# Altium schematic sheet CPLD.SchDoc
size A3; : Record=PageOptions|CenterHorizontal=True|CenterVertical=True|PrintScale=0.70|XCorrection=1.00|YCorrection=1.00|PrintKind=1|BorderSize=5000000|LeftOffset=0|BottomOffset=0|Orientation=2|PaperLength=1000|PaperWidth=1000|Scale=100|PaperSource=7|PrintQuality=-4|MediaType=1|DitherType=10|PaperKin
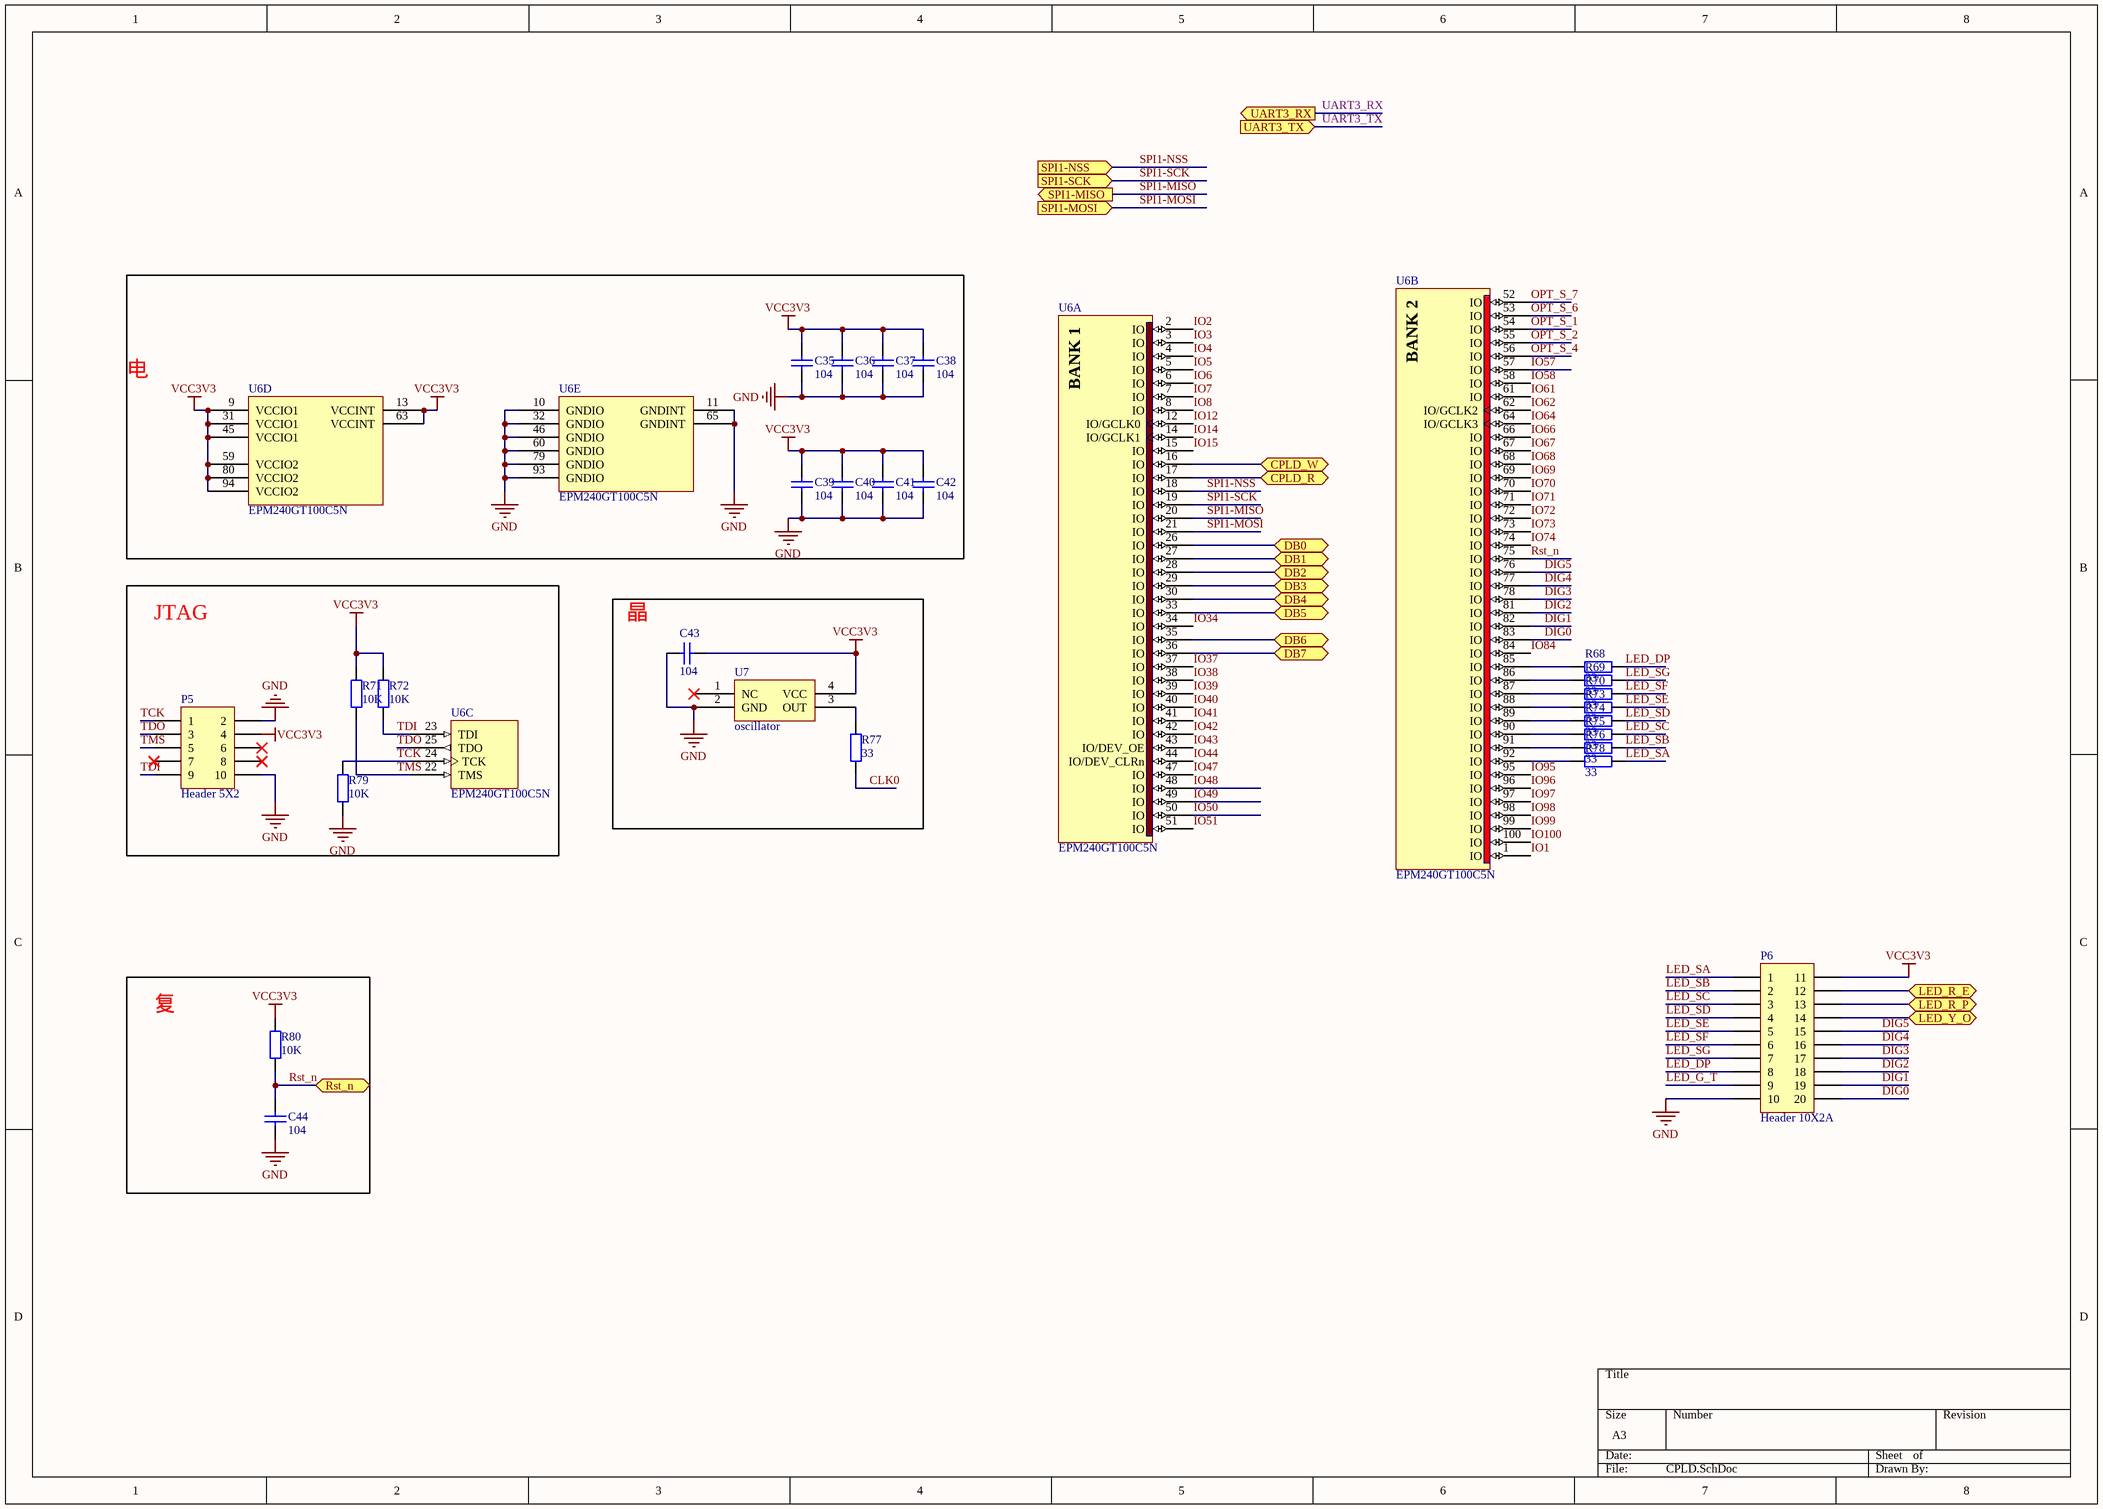
[diagram p0: CPLD.SchDoc]

## Parts
C35  value 104  [C0805]  (hidden comment: Cap)
C36  value 104  [C0805]  (hidden comment: Cap)
C37  value 104  [C0805]  (hidden comment: Cap)
C38  value 104  [C0805]  (hidden comment: Cap)
C39  value 104  [C0805]  (hidden comment: Cap)
C40  value 104  [C0805]  (hidden comment: Cap)
C41  value 104  [C0805]  (hidden comment: Cap)
C42  value 104  [C0805]  (hidden comment: Cap)
C43  value 104  [C0805]  (hidden comment: Cap)
C44  value 104  [C0805]  (hidden comment: Cap)
P5  Header 5X2  [HDR2X5]
P6  Header 10X2A  [HDR2X10_CEN]
R68  value 33  [R0805]  (hidden comment: Res2)
R69  value 33  [R0805]  (hidden comment: Res2)
R70  value 33  [R0805]  (hidden comment: Res2)
R71  value 10K  [R0805]  (hidden comment: Res2)
R72  value 10K  [R0805]  (hidden comment: Res2)
R73  value 33  [R0805]  (hidden comment: Res2)
R74  value 33  [R0805]  (hidden comment: Res2)
R75  value 33  [R0805]  (hidden comment: Res2)
R76  value 33  [R0805]  (hidden comment: Res2)
R77  value 33  [R0805]  (hidden comment: Res2)
R78  value 33  [R0805]  (hidden comment: Res2)
R79  value 10K  [R0805]  (hidden comment: Res2)
R80  value 10K  [R0805]  (hidden comment: Res2)
U6  EPM240GT100C5N  [TQFP100_N]  (parts A,B,C,D,E of 5)
U7  oscillator  [JZ]

## Blocks framed on the sheet
电: C35-C42 U6
JTAG: P5 R71 R72 R79 U6
晶: C43 R77 U7
复: C44 R80

## Ports
CPLD_R (bidir), CPLD_W (bidir), DB0 (bidir), DB1 (bidir), DB2 (bidir), DB3 (bidir), DB4 (bidir), DB5 (bidir), DB6 (bidir), DB7 (bidir), LED_R_E (bidir), LED_R_P (bidir), LED_Y_O (bidir), Rst_n (bidir), SPI1-MISO (out), SPI1-MOSI (in), SPI1-NSS (in), SPI1-SCK (in), UART3_RX (out), UART3_TX (in)

## Nets
GND: C35.1 C36.1 C37.1 C38.1 C39.1 C40.1 C41.1 C42.1 C43.1 C44.1 P5.2 P5.10 P6.10 R79.1 U6.10(GNDIO) U6.11(GNDINT) U6.32(GNDIO) U6.46(GNDIO) U6.60(GNDIO) U6.65(GNDINT) U6.79(GNDIO) U6.93(GNDIO) U7.2(GND)
VCC3V3: C35.2 C36.2 C37.2 C38.2 C39.2 C40.2 C41.2 C42.2 C43.2 P5.4 P6.11 R71.2 R72.2 R80.2 U6.9(VCCIO1) U6.13(VCCINT) U6.31(VCCIO1) U6.45(VCCIO1) U6.59(VCCIO2) U6.63(VCCINT) U6.80(VCCIO2) U6.94(VCCIO2) U7.4(VCC)
CLK0: R77.1
CPLD_R: U6.17(IO) ; port CPLD_R
CPLD_W: U6.16(IO) ; port CPLD_W
DB0: U6.26(IO) ; port DB0
DB1: U6.27(IO) ; port DB1
DB2: U6.28(IO) ; port DB2
DB3: U6.29(IO) ; port DB3
DB4: U6.30(IO) ; port DB4
DB5: U6.33(IO) ; port DB5
DB6: U6.35(IO) ; port DB6
DB7: U6.36(IO) ; port DB7
DIG0: P6.20 U6.83(IO)
DIG1: P6.19 U6.82(IO)
DIG2: P6.18 U6.81(IO)
DIG3: P6.17 U6.78(IO)
DIG4: P6.16 U6.77(IO)
DIG5: P6.15 U6.76(IO)
IO1: U6.1(IO)
IO2: U6.2(IO)
IO3: U6.3(IO)
IO4: U6.4(IO)
IO5: U6.5(IO)
IO6: U6.6(IO)
IO7: U6.7(IO)
IO8: U6.8(IO)
IO12: U6.12(IO/GCLK0)
IO14: U6.14(IO/GCLK1)
IO15: U6.15(IO)
IO34: U6.34(IO)
IO37: U6.37(IO)
IO38: U6.38(IO)
IO39: U6.39(IO)
IO40: U6.40(IO)
IO41: U6.41(IO)
IO42: U6.42(IO)
IO43: U6.43(IO/DEV_OE)
IO44: U6.44(IO/DEV_CLRn)
IO47: U6.47(IO)
IO48: U6.48(IO)
IO49: U6.49(IO)
IO50: U6.50(IO)
IO51: U6.51(IO)
IO57: U6.57(IO)
IO58: U6.58(IO)
IO61: U6.61(IO)
IO62: U6.62(IO/GCLK2)
IO64: U6.64(IO/GCLK3)
IO66: U6.66(IO)
IO67: U6.67(IO)
IO68: U6.68(IO)
IO69: U6.69(IO)
IO70: U6.70(IO)
IO71: U6.71(IO)
IO72: U6.72(IO)
IO73: U6.73(IO)
IO74: U6.74(IO)
IO84: U6.84(IO)
IO95: U6.95(IO)
IO96: U6.96(IO)
IO97: U6.97(IO)
IO98: U6.98(IO)
IO99: U6.99(IO)
IO100: U6.100(IO)
LED_DP: P6.8 R68.1
LED_G_T: P6.9
LED_R_E: P6.12 ; port LED_R_E
LED_R_P: P6.13 ; port LED_R_P
LED_SA: P6.1 R78.1
LED_SB: P6.2 R76.1
LED_SC: P6.3 R75.1
LED_SD: P6.4 R74.1
LED_SE: P6.5 R73.1
LED_SF: P6.6 R70.1
LED_SG: P6.7 R69.1
LED_Y_O: P6.14 ; port LED_Y_O
OPT_S_1: U6.54(IO)
OPT_S_2: U6.55(IO)
OPT_S_4: U6.56(IO)
OPT_S_6: U6.53(IO)
OPT_S_7: U6.52(IO)
Rst_n: C44.2 R80.1 U6.75(IO) ; port Rst_n
SPI1-MISO: U6.20(IO) ; port SPI1-MISO
SPI1-MOSI: U6.21(IO) ; port SPI1-MOSI
SPI1-NSS: U6.18(IO) ; port SPI1-NSS
SPI1-SCK: U6.19(IO) ; port SPI1-SCK
TCK: P5.1 R79.2 U6.24(TCK)
TDI: P5.9 R72.1 U6.23(TDI)
TDO: P5.3 U6.25(TDO)
TMS: P5.5 R71.1 U6.22(TMS)
UART3_RX: port UART3_RX
UART3_TX: port UART3_TX
NetR68_2: R68.2 U6.85(IO)
NetR69_2: R69.2 U6.86(IO)
NetR70_2: R70.2 U6.87(IO)
NetR73_2: R73.2 U6.88(IO)
NetR74_2: R74.2 U6.89(IO)
NetR75_2: R75.2 U6.90(IO)
NetR76_2: R76.2 U6.91(IO)
NetR77_2: R77.2 U7.3(OUT)
NetR78_2: R78.2 U6.92(IO)

Not connected (* = marked no-connect by the designer): P5 6* 7* 8*; U7 1(NC)*

## Notes on the sheet
- (in symbol EPM240GT100C5N, part A) BANK 1
- (in symbol EPM240GT100C5N, part B) BANK 2

## Library data of the parts
C35-C44 = Cap: Capacitor; Published: 8-Jun-2000; LatestRevisionDate: 17-Jul-2002; LatestRevisionNote: Re-released for DXP Platform.; PackageReference: RAD-0.3; Publisher: Altium Limited
P5 = Header 5X2: Header, 5-Pin, Dual row; LatestRevisionDate: 17-Jul-2002; LatestRevisionNote: Re-released for DXP Platform.; Publisher: Altium Limited
P6 = Header 10X2A: Header, 10-Pin, Dual row; LatestRevisionDate: 17-Jul-2002; LatestRevisionNote: Re-released for DXP Platform.; Publisher: Altium Limited
R68-R80 = Res2: Resistor; Published: 8-Jun-2000; LatestRevisionDate: 17-Jul-2002; LatestRevisionNote: Re-released for DXP Platform.; PackageReference: AXIAL-0.4; Publisher: Altium Limited
U6 = EPM240GT100C5N: MAX II 1.8V CPLD, 80 IOs, 240 Logic Elements, 100-Pin Plastic TQFP, Commercial Temperature, Speed Grade 5, Pb-Free; Note: Each set of VCCIO pins can be connected to 3.3V, 2.5V, 1.8V, or 1.5V.; Note: All VCCINT pins must be connected to 1.8V.; Published: 4-Mar-2005; LatestRevisionDate: 13-Apr-2006; LatestRevisionNote: IPC-7351 Footprint Added.; DatasheetVersion: ver1.8, Jul-2006; PackageVersion: ver14.3, Jul-2006; PackageReference: TQFP100; Publisher: Altium Limited; PackageDescription: 100-Pin Plastic Thin Quad Flat Pack (TQFP100); Code_JEDEC: MS-026-AED; ComponentLink1Description: Manufacturer Link; ComponentLink1URL: http://www.altera.com/products/devices/cpld/max2/mx2-index.jsp; ComponentLink2Description: Handbook; ComponentLink2URL: http://www.altera.com/literature/hb/max2/max2_mii5v1.pdf; ComponentLink3Description: Packaging Specification; ComponentLink3URL: http://www.altera.com/literature/ds/dspkg.pdf